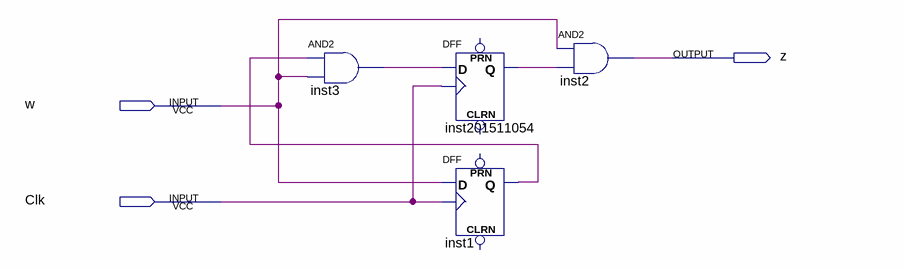
[diagram p0: schematic sheet]
// Quartus schematic lab06_2.bdf as structural Verilog: 4 symbols, 3 pins
module lab06_2 (
  input  w,
  input  Clk,
  output z
);

  wire inst1_q, inst3_out, inst201511054_q;

  and inst3 (inst3_out, inst1_q, w);
  DFF inst201511054 (.CLK(Clk), .D(inst3_out), .Q(inst201511054_q));  // open: CLRN, PRN
  DFF inst1 (.CLK(Clk), .D(w), .Q(inst1_q));  // open: CLRN, PRN
  and inst2 (z, w, inst201511054_q);
endmodule
